# EAGLE design USBDUINO_DIP_SCH (EAGLE 9.6.2)
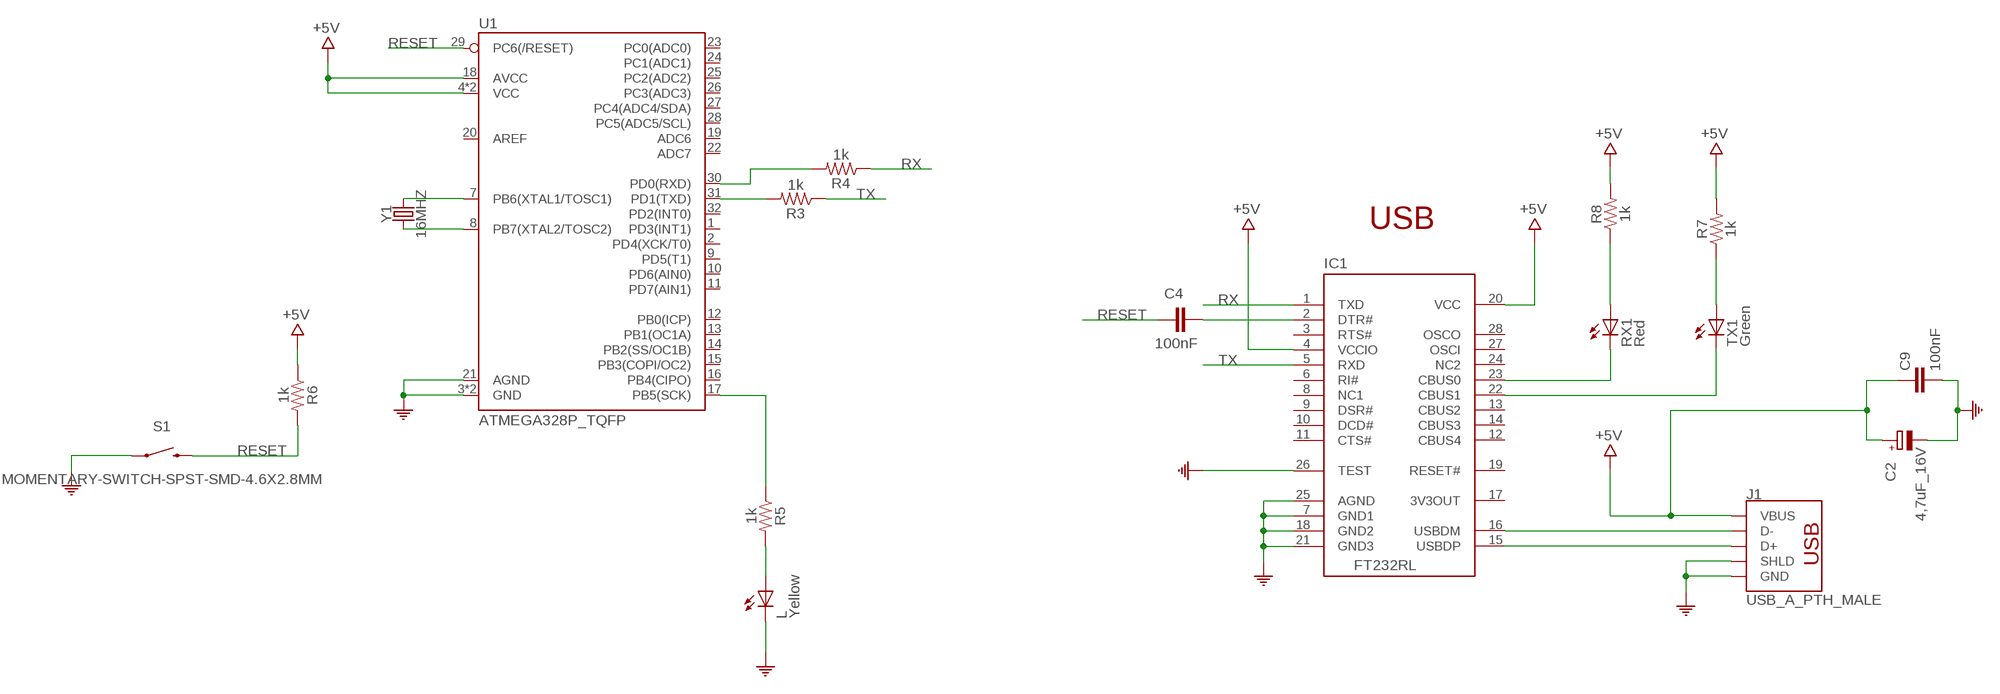
[diagram p0: schematic, sheet 1]

## Parts
C2  4,7uF_16V  0833_TAJA475MO16RNJ  [TAN-A]
C4  100nF  0015_100NF_0603  [C0603-ROUND]
C9  100nF  0015_100NF_0603  [C0603-ROUND]
IC1  FT232RL  0226_FT232RL  [SSOP28]
J1  USB_A_PTH_MALE  [USB-A-H]
L  Yellow  0044_KPT-2012YC  [CHIPLED_0805]
R3  1k  1KOHM-0603-1/10W-1%  [0603]
R4  1k  1KOHM-0603-1/10W-1%  [0603]
R5  1k  1KOHM-0603-1/10W-1%  [0603]
R6  1k  1KOHM-0603-1/10W-1%  [0603]
R7  1k  1KOHM-0603-1/10W-1%  [0603]
R8  1k  1KOHM-0603-1/10W-1%  [0603]
RX1  Red  0181_KTP-2012SURCK  [CHIPLED_0805]
S1  MOMENTARY-SWITCH-SPST-SMD-4.6X2.8MM  [TACTILE_SWITCH_SMD_4.6X2.8MM]
TX1  Green  0043_KPT-2012SGC  [CHIPLED_0805]
U1  ATMEGA328P_TQFP  [TQFP32-08]
Y1  16MHZ  CRYSTALSMD-HC49UP  [HC49UP]

## Nets
+5V [Power]: C2.1(+) C9.1 IC1.4(VCCIO) IC1.20(VCC) J1.VBUS R6.1 R7.2 R8.2 U1.4(VCC) U1.6(VCC) U1.18(AVCC)
COM [Power]: C2.2(-) C9.2 IC1.7(GND1) IC1.18(GND2) IC1.21(GND3) IC1.25(AGND) IC1.26(TEST) J1.GND J1.SHLD1(SHLD) J1.SHLD2(SHLD) L.C S1.1 S1.2 U1.3(GND) U1.5(GND) U1.21(AGND)
D13/SCK [signal]: R5.1 U1.17(PB5(SCK))
N$3 [signal]: U1.7(PB6(XTAL1/TOSC1)) Y1.2
N$4 [signal]: C4.2 IC1.2(DTR#)
N$5 [signal]: IC1.15(USBDP) J1.D+
N$6 [signal]: IC1.16(USBDM) J1.D-
N$7 [signal]: L.A R5.2
N$8 [signal]: IC1.23(CBUS0) RX1.C
N$9 [signal]: IC1.22(CBUS1) TX1.C
N$10 [signal]: U1.8(PB7(XTAL2/TOSC2)) Y1.1
N$11 [signal]: R7.1 TX1.A
N$12 [signal]: R3.2 U1.31(PD1(TXD))
N$13 [signal]: R4.2 U1.30(PD0(RXD))
N$29 [signal]: R8.1 RX1.A
RESET [signal]: C4.1 R6.2 S1.3 S1.4 U1.29(PC6(/RESET))
RX [signal]: IC1.1(TXD) R4.1
TX [signal]: IC1.5(RXD) R3.1
Unconnected: IC1.3(RTS#) IC1.6(RI#) IC1.8(NC1) IC1.9(DSR#) IC1.10(DCD#) IC1.11(CTS#) IC1.12(CBUS4) IC1.13(CBUS2) IC1.14(CBUS3) IC1.19(RESET#) IC1.24(NC2) IC1.27(OSCI) IC1.28(OSCO) U1.1(PD3(INT1)) U1.2(PD4(XCK/T0)) U1.9(PD5(T1)) U1.10(PD6(AIN0)) U1.11(PD7(AIN1)) U1.12(PB0(ICP)) U1.13(PB1(OC1A)) U1.14(PB2(SS/OC1B)) U1.15(PB3(COPI/OC2)) U1.16(PB4(CIPO)) U1.19(ADC6) U1.20(AREF) U1.22(ADC7) U1.23(PC0(ADC0)) U1.24(PC1(ADC1)) U1.25(PC2(ADC2)) U1.26(PC3(ADC3)) U1.27(PC4(ADC4/SDA)) U1.28(PC5(ADC5/SCL)) U1.32(PD2(INT0))

## Notes on the sheet
- USB

## Power pins joined to a net without a drawn wire
3V3OUT: IC1.17(3V3OUT)

## Library data of the parts
C2 = Condensatori:0833_TAJA475MO16RNJ: 4,7uF; CASE: Case_A_(1206); MONTHLY_USAGE: _____; PART_NUMBER: TAJA475MO16RNJ; PRICE: _____; SUPPLIER: _____; TYPE: Condensatori
C4 C9 = Condensatori:0015_100NF_0603: 100nF 0603 50V; CASE: 0603; MONTHLY_USAGE: _____; PART_NUMBER: cl10b104kbnc; PRICE: _____; SUPPLIER: _____; TYPE: Condensatori
IC1 = IntegratedCircuits:0226_FT232RL: USB to serial UART interface -FT232RL; CASE: SSOP28; MONTHLY_USAGE: _____; PART_NUMBER: FT232RL; PRICE: _____; SUPPLIER: _____; TYPE: Circuito_Integrato
J1 = SparkFun-Connectors:USB_A: USB-A Connector Male and female variants, as well as PTH and SMT variants SparkFun Products: SparkFun XBee Explorer Dongle <https://www.sparkfun.com/products/11697> PTH Male SparkFun MicroView-USB Programmer <https://www.sparkfun.com/products/12924> SMT Male SparkFun USB Type A Female Breakout <https://www.sparkfun.com/products/12700> SMT Female; PROD_ID: CONN-08367; SF_ID: PRT-00437
L = Opto:0044_KPT-2012YC: LED YELLOW - SMD - 0805; MONTHLY_USAGE: _____; PART_NUMBER: KPT-2012YC; PRICE: _____; SUPPLIER: _____; TYPE: Opto
R3-R8 = SparkFun-Resistors:1KOHM: 1kΩ resistor A resistor is a passive two-terminal electrical component that implements electrical resistance as a circuit element. Resistors act to reduce current flow, and, at the same time, act to lower voltage levels within circuits. - Wikipedia; PROD_ID: RES-07856
RX1 = Opto:0181_KTP-2012SURCK: LED RED - SMD - 0805; MONTHLY_USAGE: _____; PART_NUMBER: KTP-2012SURCK; PRICE: _____; SUPPLIER: _____; TYPE: Opto
S1 = SparkFun-Switches:MOMENTARY-SWITCH-SPST: Momentary Switch (Pushbutton) - SPST Normally-open (NO) SPST momentary switches (buttons, pushbuttons). Variants PTH-12MM - 12mm square, through-hole Momentary Pushbutton Switch - 12mm Square <https://www.sparkfun.com/products/9190> (COM-09190) PTH-6.0MM, PTH-6.0MM-KIT - 6.0mm square, through-hole Mini Pushbutton Switch <https://www.sparkfun.com/products/97> (COM-00097) KIT package intended for soldering kit's - only one side of pads' copper is exposed. PTH-RIGHT-ANGLE-KIT - Right-angle, through-hole Right Angle Tactile Button <https://www.sparkfun.com/products/10791> - Used on SparkFun BigTime Watch Kit <https://www.sparkfun.com/products/11734> SMD-12MM - 12mm square, surface-mount Tactile Button - SMD (12mm) <https://www.sparkfun.com/products/12993> (COM-12993) Used on SparkFun PicoBoard <https://www.sparkfun.com/products/11888> SMD-4.5MM - 4.5mm Square Trackball Switch Used on SparkFun Blackberry Trackballer Breakout <https://www.sparkfun.com/products/13169> SMD-4.6MMX2.8MM - 4.60mm x 2.80mm, surface mount Used on SparkFun Pro Micro - RP2040 <https://www.sparkfun.com/products/17717> SMD-5.2MM, SMD-5.2-REDUNDANT - 5.2mm square, surface-mount Mini Pushbutton Switch - SMD <https://www.sparkfun.com/products/8720> (COM-08720) Used on Arduino Pro Mini <https://www.sparkfun.com/products/11114> REDUNDANT package connects both switch circuits together SMD-6.0X3.5MM - 6.0 x 3.5mm, surface mount Momentary Reset Switch SMD <https://www.sparkfun.com/products/8229> (COM-08229) SMD-6.2MM-TALL - 6.2mm square, surface mount Tactile Button - SMD (6mm) <https://www.sparkfun.com/products/12992> Used on SparkFun Digital Sandbox <https://www.sparkfun.com/products/12651> SMD-RIGHT-ANGLE - Right-angle, surface mount Used on SparkFun Block for Intel® Edison - Arduino <https://www.sparkfun.com/products/13036>; PROD_ID: SWCH-15606
TX1 = Opto:0043_KPT-2012SGC: LED GREEN - SMD-0805; MONTHLY_USAGE: _____; PART_NUMBER: KPT-2012SGC; PRICE: _____; SUPPLIER: _____; TYPE: Opto
U1 = SparkFun-IC-Microcontroller:ATMEGA328P_TQFP: Popular 328P in QFP Storefront component: ATmega328 - TQFP <https://www.sparkfun.com/products/13448> (COM-13448) Datasheet <http://www.sparkfun.com/datasheets/Components/SMD/ATMega328.pdf> SparkFun Products SparkFun RedBoard - Programmed with Arduino <https://www.sparkfun.com/products/12757> (DEV-12757) Arduino Pro Mini 328 - 5V/16MHz <https://www.sparkfun.com/products/11113> (DEV-11113) Arduino Pro Mini 328 - 3.3V/8MHz <https://www.sparkfun.com/products/11114> (DEV-11114) SparkFun OpenLog <https://www.sparkfun.com/products/13712> (DEV-13712) SparkFun MicroView - OLED Arduino Module <https://www.sparkfun.com/products/12923> (DEV-12923) SparkFun Digital Sandbox <https://www.sparkfun.com/products/12651> (DEV-12651) SparkFun PicoBoard <https://www.sparkfun.com/products/11888> (WIG-11888) Arduino Fio <https://www.sparkfun.com/products/10116> (DEV-10116) LilyPad Arduino 328 Main Board <https://www.sparkfun.com/products/13342> (DEV-13342) SparkFun RedStick <https://www.sparkfun.com/products/13741> (DEV-13741) LilyPad MP3 <https://www.sparkfun.com/products/11013> (DEV-11013) LilyPad Arduino SimpleSnap <https://www.sparkfun.com/products/10941> (DEV-10941) SparkFun Stepoko <https://www.sparkfun.com/products/13899> (ROB-13899) SparkFun Geiger Counter <https://www.sparkfun.com/products/11345> (SEN-11345) SparkFun EL Sequencer <https://www.sparkfun.com/products/12781> (COM-12781) Arduino Pro 328 - 5V/16MHz <https://www.sparkfun.com/products/10915> (DEV-10915) CryptoCape <https://www.sparkfun.com/products/12773> (DEV-12773) SparkFun IR Thermometer Evaluation Board - MLX90614 <https://www.sparkfun.com/products/10740> (SEN-10740) SparkFun RedBot Mainboard <https://www.sparkfun.com/products/12097> (ROB-12097) Arduino Pro 328 - 3.3V/8MHz <https://www.sparkfun.com/products/10914> (DEV-10914) SparkFun Block for Intel® Edison - Arduino <https://www.sparkfun.com/products/13036> (DEV-13036) SparkFun Simon Says - Surface Mount Soldering Kit <https://www.sparkfun.com/products/10935> (KIT-10935) SparkFun 7-Segment Serial Display - Red <https://www.sparkfun.com/products/11441> (COM-11441) SparkFun 7-Segment Serial Display - White <https://www.sparkfun.com/products/11629> (COM-11629) SparkFun 7-Segment Serial Display - Yellow <https://www.sparkfun.com/products/11443> (COM-11443) SparkFun 7-Segment Serial Display - Kelly Green <https://www.sparkfun.com/products/11440> (COM-11440) SparkFun 7-Segment Serial Display - Blue <https://www.sparkfun.com/products/11442> (COM-11442) SparkFun OpenSegment Serial Display - 20mm (Blue) <https://www.sparkfun.com/products/11647> (COM-11647) SparkFun OpenSegment Serial Display - 20mm (Green) <https://www.sparkfun.com/products/11646> (COM-11646) SparkFun OpenSegment Serial Display - 20mm (White) <https://www.sparkfun.com/products/11648> (COM-11648) SparkFun OpenSegment Serial Display - 20mm (Red) <https://www.sparkfun.com/products/11644> (COM-11644) SparkFun OpenSegment Serial Display - 20mm (Yellow) <https://www.sparkfun.com/products/11645> (COM-11645) SparkFun OpenSegment Shield <https://www.sparkfun.com/products/13190> (DEV-13190); PROD_ID: IC-09069
Y1 = SparkFun-Clocks:CRYSTAL: Crystals (Generic) These are passive quartz crystals, which can be used as a clock source for a microcontroller. Crystal's are two-terminal devices. They require external "load" capacitors to generate an oscillating signal.

## Net classes
1 Power: width 0.406 mm, clearance 0.406 mm
2 signal: width 0.406 mm, clearance 0.406 mm

## Board
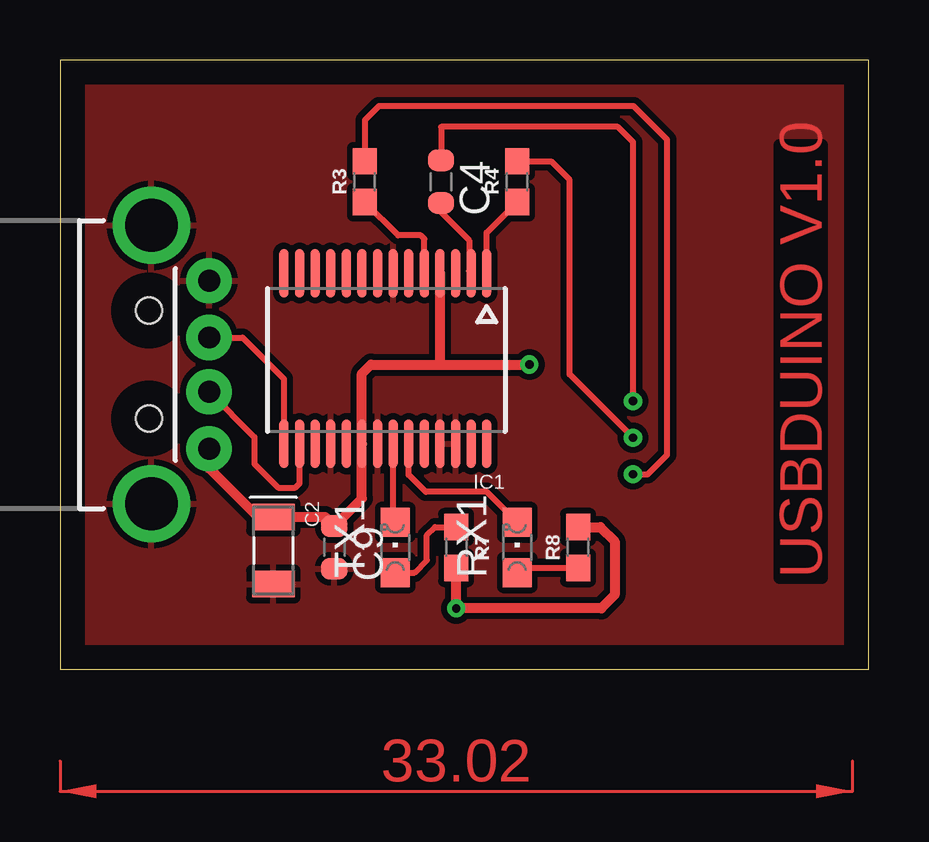
[diagram p1: board, top side]
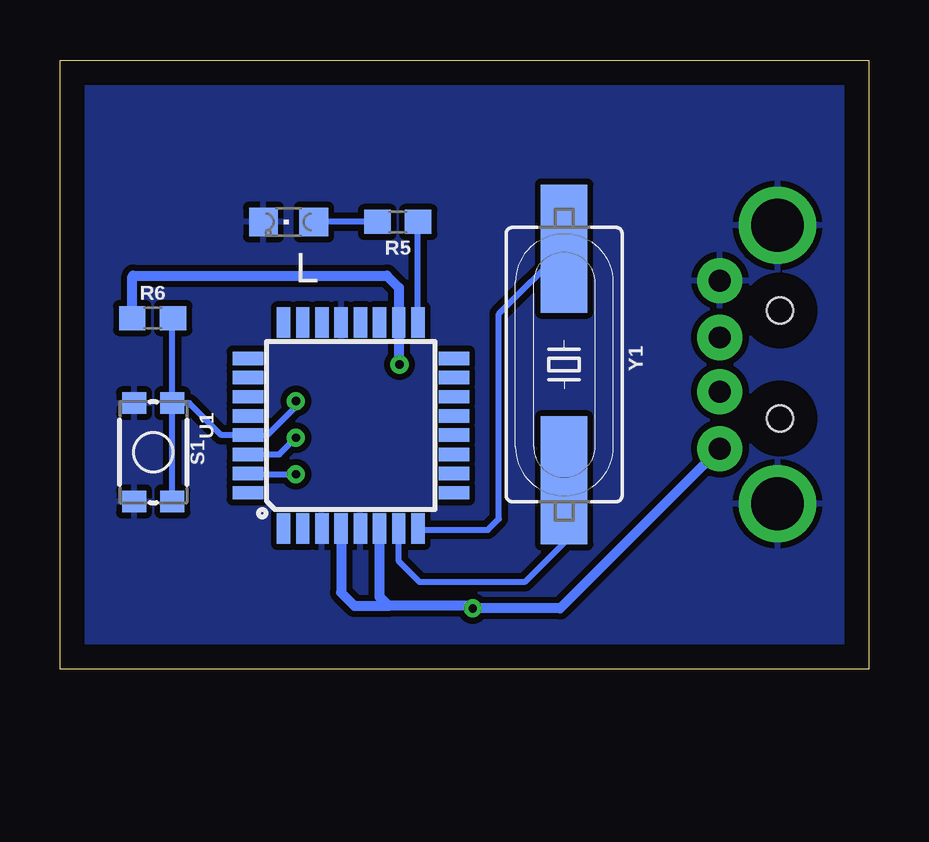
[diagram p2: board, bottom side, seen from below]

Size 33.71 x 25.39 mm. Coordinates in mm from the lower left corner, seen from the top.
Outline: 0,0 33.71,0 33.71,25.39 0,25.39 0,0
Copper layers (1*16): Top 0.035mm / dielectric 1.5mm / Bottom 0.035mm
Design rules "default": minimum track width 6mil, minimum drill 0.35mm, track to track 6mil, track to pad 6mil, pad to pad 6mil, via to via 6mil, smd to smd 6mil, copper to edge 40mil, drill to drill 6mil, minimum pad ring 10mil, minimum via ring 8mil, stop-mask expansion 4mil, vias tented up to drill 0mil, thermal gap 10mil

### Footprints (pad centres in the part's own frame; a part is rotated, then mirrored left to right if it is on the bottom)
TAN-A = smd 1.118 x 1.778: 1 0,0; 2 2.794,0
C0603-ROUND = smd 0.898 x 1.1: 1 -0.889,0; 2 0.889,0
SSOP28 = smd 0.381 x 2.032: 1 0,0; 2 0.65,0; 3 1.3,0; 4 1.95,0; 5 2.6,0; 6 3.25,0; 7 3.9,0; 8 4.55,0; 9 5.2,0; 10 5.85,0; 11 6.5,0; 12 7.15,0; 13 7.8,0; 14 8.45,0; 15 8.45,7.112; 16 7.8,7.112; 17 7.15,7.112; 18 6.5,7.112; 19 5.85,7.112; 20 5.2,7.112; 21 4.55,7.112; 22 3.9,7.112; 23 3.25,7.112; 24 2.6,7.112; 25 1.95,7.112; 26 1.3,7.112; 27 0.65,7.112; 28 0,7.112
USB-A-H = drill 0.914 pad 1.88: D+ 2.4,1.127; D- 2.4,-1.127; GND 2.4,3.5; VBUS 2.4,-3.5 | drill 2.2: SHLD1 0,-5.8; SHLD2 0,5.8 | hole 1.1: -0.1,2.25; -0.1,-2.25
CHIPLED_0805 = smd 1.2 x 1.2: A 0,-1.05; C 0,1.05
0603 = smd 1.1 x 1: 1 -0.85,0; 2 0.85,0
TACTILE_SWITCH_SMD_4.6X2.8MM = smd 0.9 x 1: 1 -2.05,-0.8; 2 2.05,-0.8; 3 2.05,0.8; 4 -2.05,0.8
TQFP32-08 = smd 1.27 x 0.559: 1 -4.293,2.8; 2 -4.293,2; 3 -4.293,1.2; 4 -4.293,0.4; 5 -4.293,-0.4; 6 -4.293,-1.2; 7 -4.293,-2; 8 -4.293,-2.8; 17 4.293,-2.8; 18 4.293,-2; 19 4.293,-1.2; 20 4.293,-0.4; 21 4.293,0.4; 22 4.293,1.2; 23 4.293,2; 24 4.293,2.8 | smd 0.559 x 1.27: 9 -2.8,-4.293; 10 -2,-4.293; 11 -1.2,-4.293; 12 -0.4,-4.293; 13 0.4,-4.293; 14 1.2,-4.293; 15 2,-4.293; 16 2.8,-4.293; 25 2.8,4.293; 26 2,4.293; 27 1.2,4.293; 28 0.4,4.293; 29 -0.4,4.293; 30 -1.2,4.293; 31 -2,4.293; 32 -2.8,4.293
HC49UP = smd 5.334 x 1.93: 1 -4.826,0; 2 4.826,0

### Placement (x,y rotation side)
C2  8.89,6.35 270 top
C4  15.88,20.32 270 top
C9  11.43,5.08 270 top
IC1  17.78,16.51 180 top
J1  3.81,12.7 0 top
L  24.18,18.64 90 bottom
R3  12.7,20.32 90 top
R4  19.05,20.32 90 top
R5  19.63,18.64 180 bottom
R6  29.84,14.63 0 bottom
R7  16.51,5.08 270 top
R8  21.59,5.08 90 top
RX1  19.05,5.08 0 top
S1  29.82,9.04 270 bottom
TX1  13.97,5.08 0 top
U1  21.59,10.16 90 bottom
Y1  12.7,12.7 270 bottom

### Tracks (layer width: path | path; a pad name or v marks a point on that pad's centre or on a via)
+5V  (via drill 0.35)
  Top 0.406: R7.2 v16.51,2.54 22.55,2.54 23.11,3.1 23.11,5.33 22.52,5.93 R8.2 | 15.82,12.7 12.95,12.7 12.58,12.33 IC1.20 12.58,7.12 C9.1 11.05,6.35 C2.1 8.23,6.35 6.21,8.37 J1.VBUS | 15.82,12.7 v19.56,12.7 | 15.82,12.7 15.83,12.71 IC1.4
  Bottom 0.406: 20.02,2.64 20.39,3.02 U1.6 | U1.4 21.99,3.19 21.44,2.64 20.02,2.64 | R6.1 30.7,16.37 30.66,16.41 20.09,16.41 19.59,15.91 U1.18 19.59,12.73 v19.56,12.7 | J1.VBUS 12.87,2.54 v16.51,2.54 16.61,2.64 20.02,2.64
COM
  pour Top: 0,0 0,25.4 34.29,25.4 34.29,0
  pour Bottom: 0,0 0,25.4 34.29,25.4 34.29,0
D13/SCK
  Bottom 0.254: U1.17 R5.1
N$3
  Bottom 0.254: Y1.2 12.7,5.28 14.35,3.63 18.72,3.63 19.59,4.5 U1.7
N$4
  Top 0.254: C4.2 15.88,19.05 17.05,17.87 17.05,16.59 IC1.2
N$5
  Top 0.254: J1.D+ 7.61,13.83 9.33,12.11 IC1.15
N$6
  Top 0.254: J1.D- 8.1,9.68 8.1,8.56 9.09,7.57 9.8,7.57 9.98,7.75 IC1.16
N$7
  Bottom 0.254: R5.2 L.A
N$8
  Top 0.254: RX1.C 17.79,7.39 15.24,7.39 14.53,8.1 IC1.23
N$9
  Top 0.254: TX1.C 13.88,6.22 IC1.22
N$10
  Bottom 0.254: U1.8 18.74,5.82 15.88,5.82 15.42,6.27 15.42,14.81 Y1.1
N$11
  Top 0.254: TX1.A 14.77,4.03 15.29,4.55 15.29,5.59 15.63,5.93 R7.1
N$12  (via drill 0.35)
  Top 0.254: v23.88,8.13 24.49,8.13 25.3,8.94 25.3,22.07 23.9,23.47 13.28,23.47 12.7,22.89 R3.2
  Bottom 0.254: U1.31 25.85,8.13 v23.88,8.13
N$13  (via drill 0.35)
  Top 0.254: v23.88,9.65 21.23,12.29 21.23,20.4 20.46,21.17 R4.2
  Bottom 0.254: U1.30 24.57,8.96 v23.88,9.65
N$29
  Top 0.254: RX1.A 19.25,4.23 R8.1
RESET  (via drill 0.35)
  Top 0.254: v23.88,11.18 23.88,21.97 23.24,22.61 15.88,22.61 C4.1
  Bottom 0.254: v23.88,11.18 23.88,10.95 25.06,9.76 U1.29 26.98,9.76 28.31,11.09 S1.4 | S1.3 S1.4 | S1.4 29.02,14.61 R6.2
RX
  Top 0.254: IC1.1 17.78,18.2 R4.1
TX
  Top 0.254: IC1.5 15.18,17.94 15.04,18.09 14.09,18.09 R3.1
(copper drawn outside any net)
  shapes: Top area x2

### Text on the board
Top: USBDUINO V1.0